# Altium project netv2mvp-testhat-v1.PrjPcb
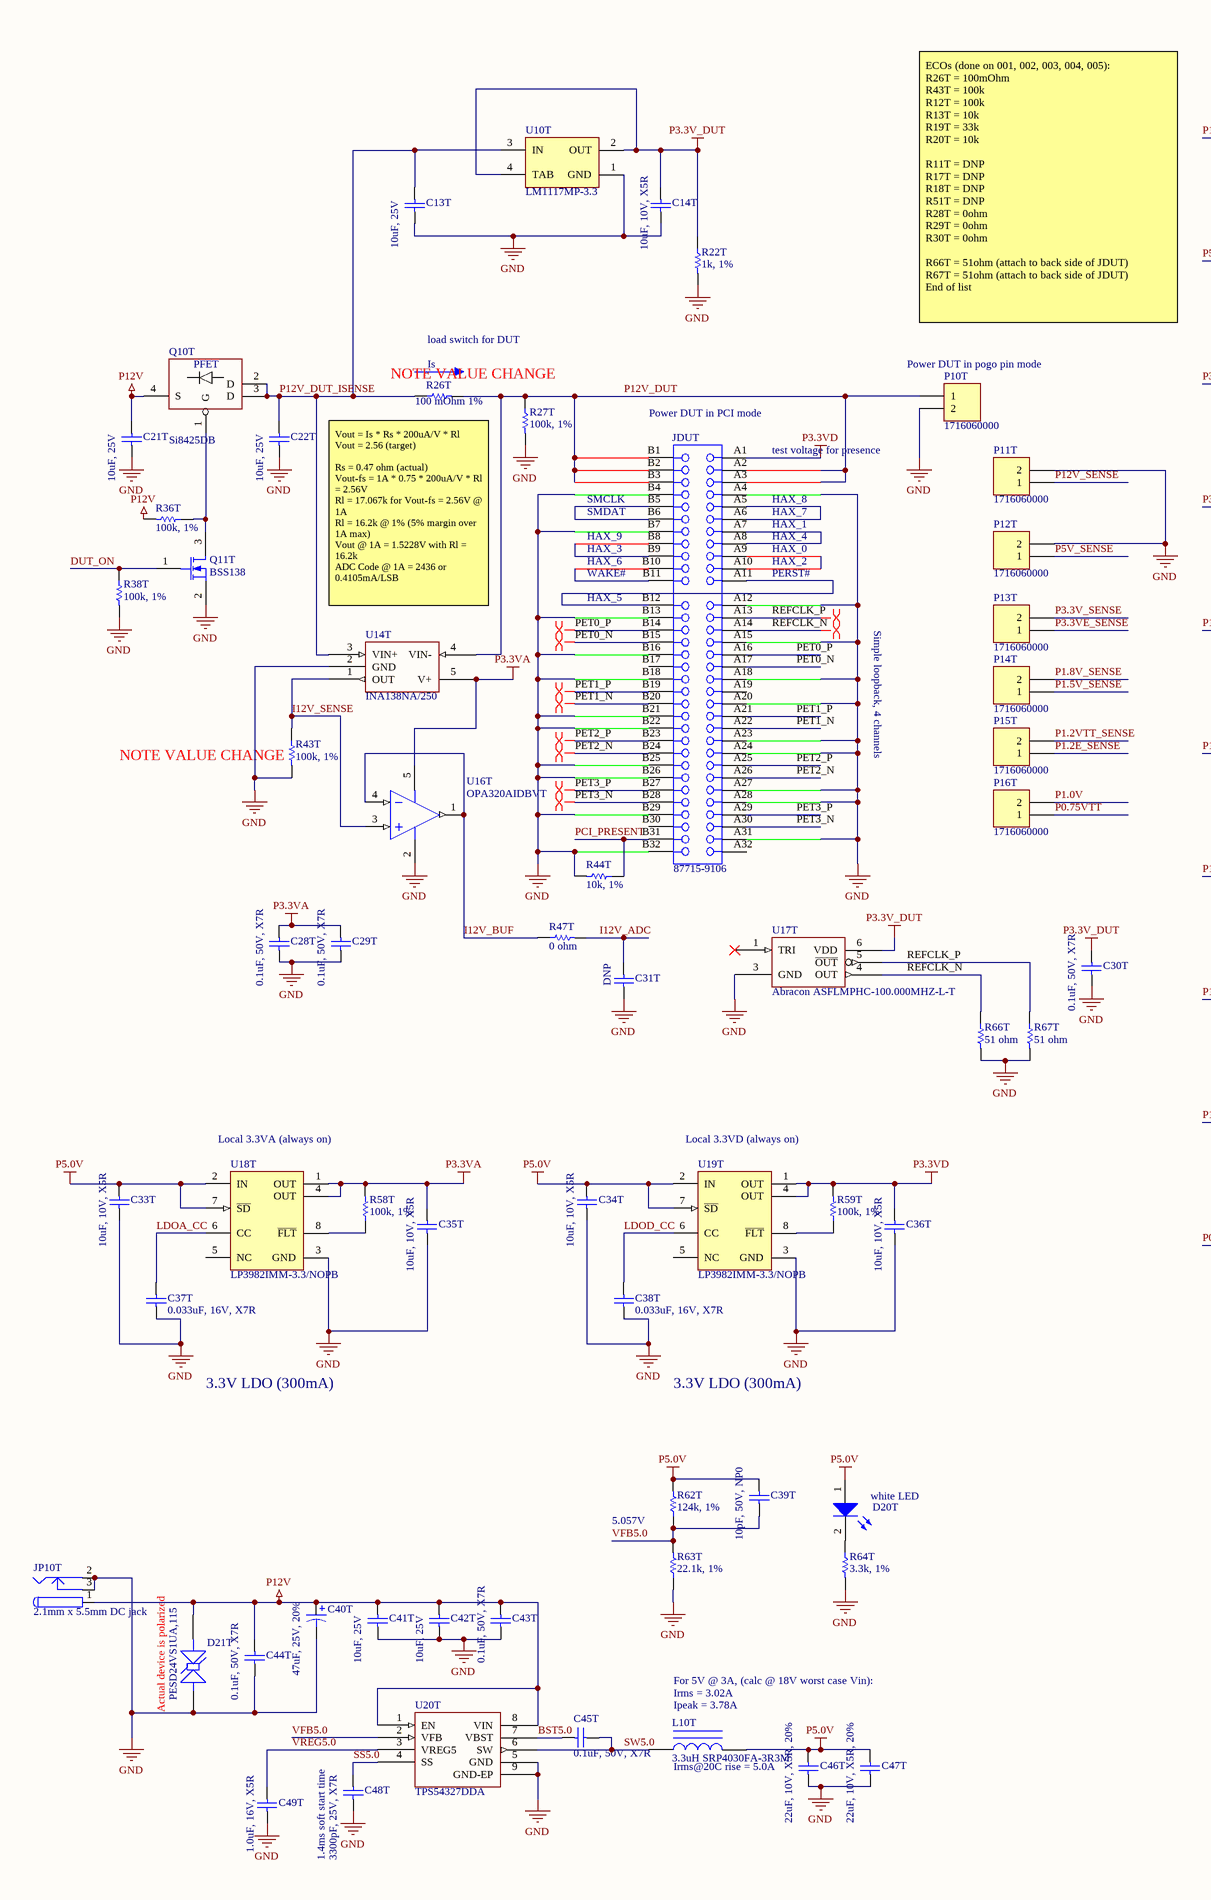
[diagram p0: testhat1.SchDoc, left]
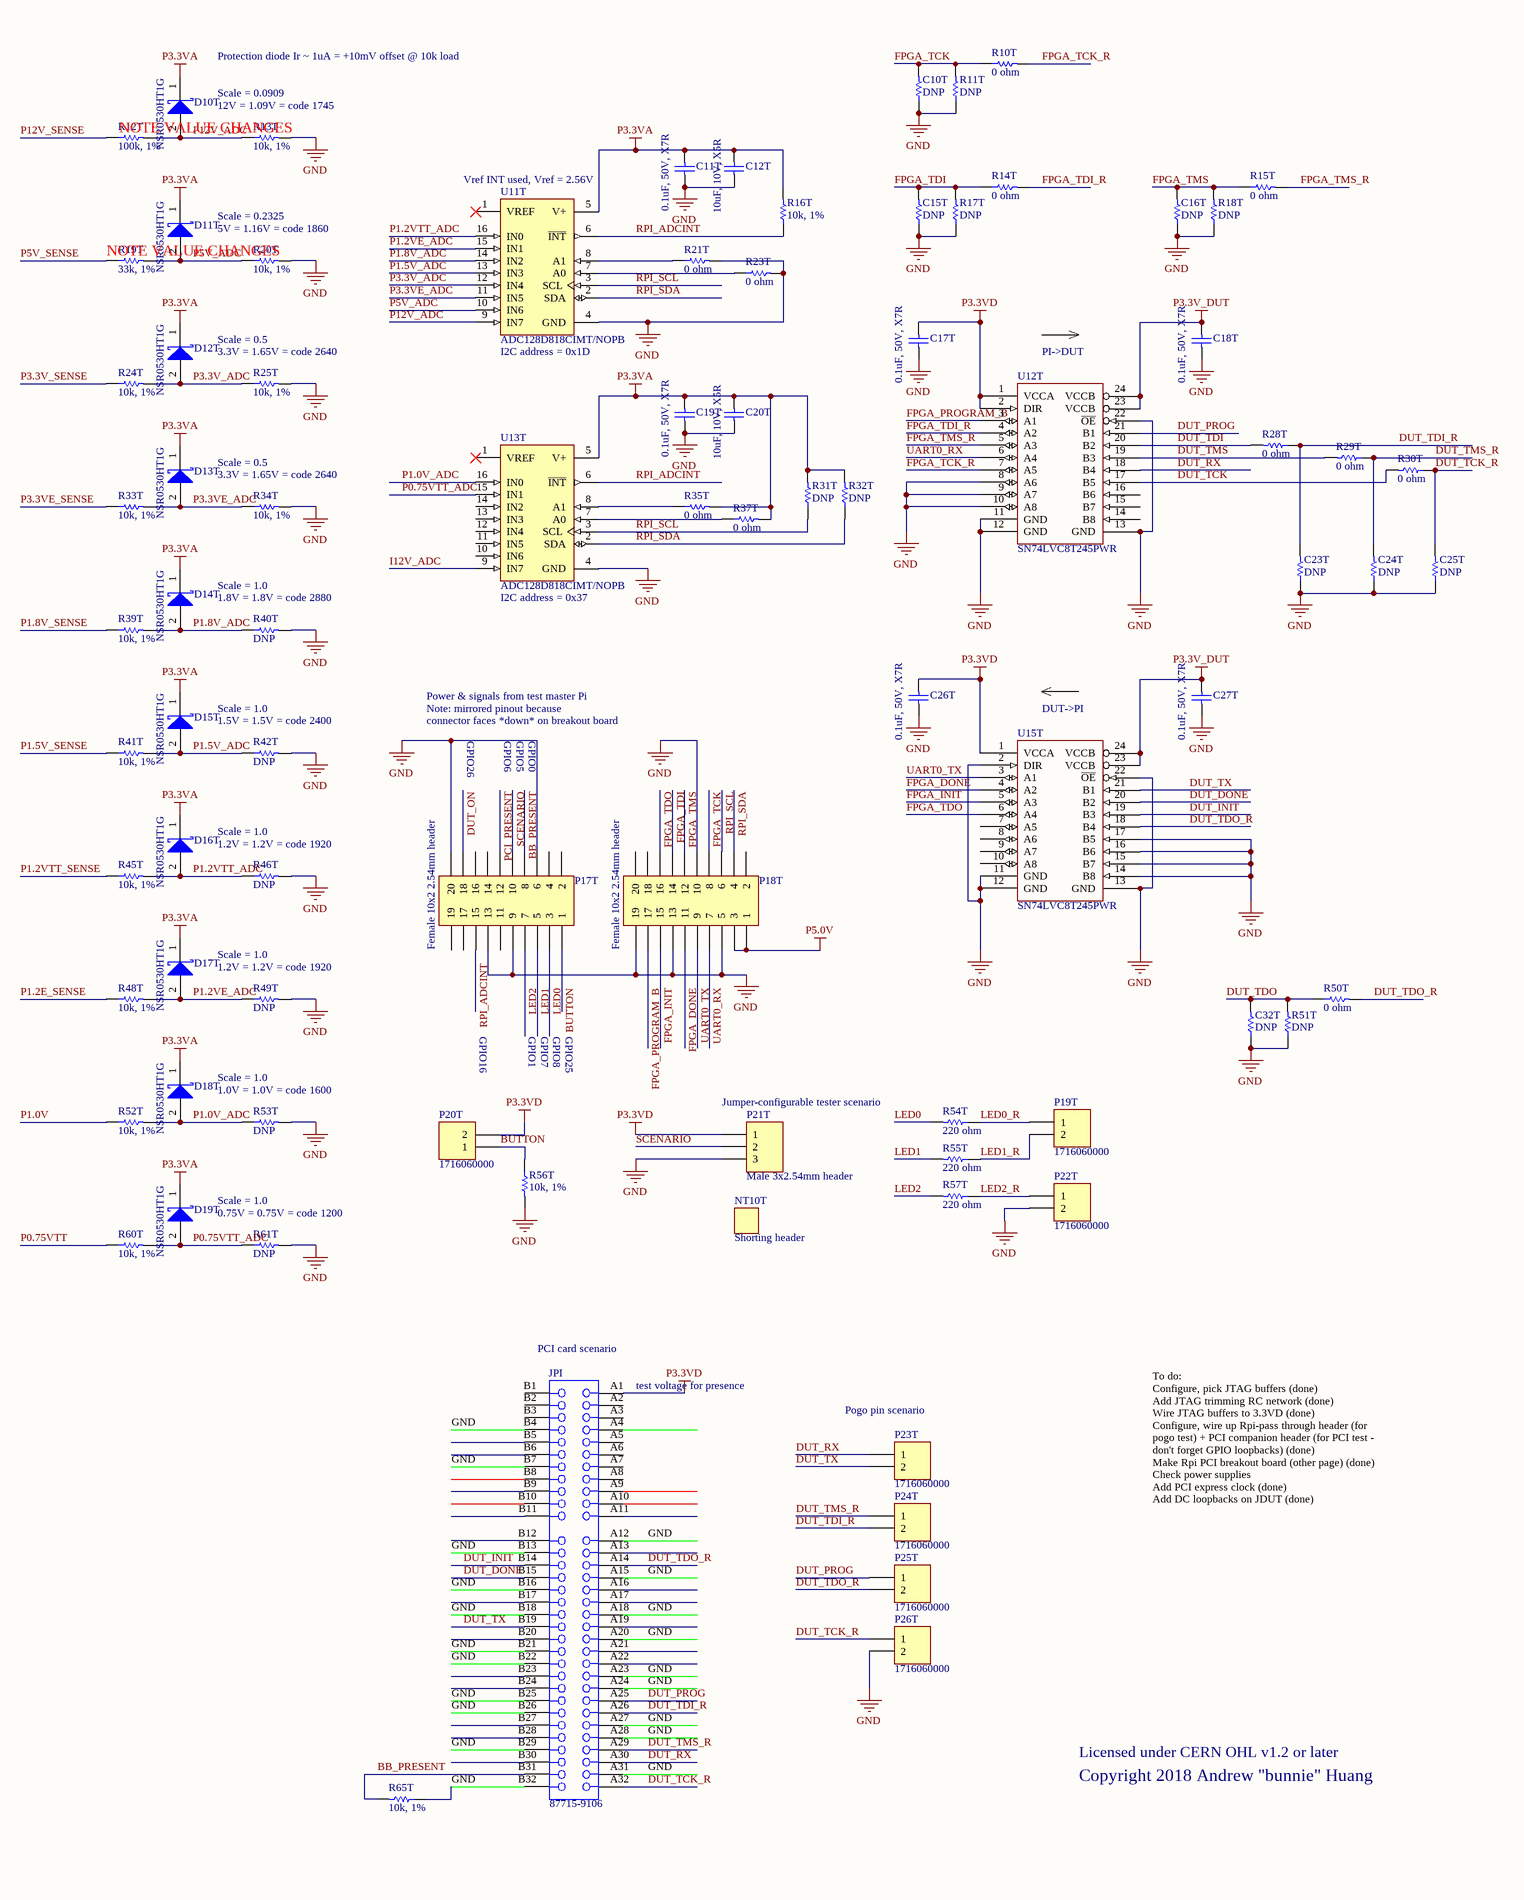
[diagram p1: testhat1.SchDoc, right]
2 sheets, 147 parts. Net scope: global (net labels, ports and power ports of the same name join across sheets).
Board file: netv2mvp-testhat-v1-route.PCBDOC
Sheets:
  testhat1.SchDoc
  pi2pci.SchDoc

## Sheet testhat1.SchDoc
size A2

### Parts
C10T  DNP  [RESC1608N]
C11T  0.1uF, 50V, X7R  [CAPC2012N]
C12T  10uF, 10V, X5R  [CAPC2012N]
C13T  10uF, 25V  [CAPC3216N]
C14T  10uF, 10V, X5R  [CAPC2012N]
C15T  DNP  [RESC1608N]
C16T  DNP  [RESC1608N]
C17T  0.1uF, 50V, X7R  [CAPC2012N]
C18T  0.1uF, 50V, X7R  [CAPC2012N]
C19T  0.1uF, 50V, X7R  [CAPC2012N]
C20T  10uF, 10V, X5R  [CAPC2012N]
C21T  10uF, 25V  [CAPC3216N]
C22T  10uF, 25V  [CAPC3216N]
C23T  DNP  [RESC1608N]
C24T  DNP  [RESC1608N]
C25T  DNP  [RESC1608N]
C26T  0.1uF, 50V, X7R  [CAPC2012N]
C27T  0.1uF, 50V, X7R  [CAPC2012N]
C28T  0.1uF, 50V, X7R  [CAPC2012N]
C29T  0.1uF, 50V, X7R  [CAPC2012N]
C30T  0.1uF, 50V, X7R  [CAPC2012N]
C31T  DNP  [CAPC2012N]
C32T  DNP  [RESC1608N]
C33T  10uF, 10V, X5R  [CAPC2012N]
C34T  10uF, 10V, X5R  [CAPC2012N]
C35T  10uF, 10V, X5R  [CAPC2012N]
C36T  10uF, 10V, X5R  [CAPC2012N]
C37T  0.033uF, 16V, X7R  [CAPC1005N]
C38T  0.033uF, 16V, X7R  [CAPC1005N]
C39T  10pF, 50V, NP0  [CAPC1005N]
C40T  47uF, 25V, 20%  [CAPAE7066X61N]
C41T  10uF, 25V  [CAPC3216N]
C42T  10uF, 25V  [CAPC3216N]
C43T  0.1uF, 50V, X7R  [CAPC2012N]
C44T  0.1uF, 50V, X7R  [CAPC2012N]
C45T  0.1uF, 50V, X7R  [CAPC2012N]
C46T  22uF, 10V, X5R, 20%  [CAPC2012N]
C47T  22uF, 10V, X5R, 20%  [CAPC2012N]
C48T  3300pF, 25V, X7R  [CAPC1005N]
C49T  1.0uF, 16V, X5R  [CAPC1005N]
D10T  NSR0530HT1G  [SOD-323]
D11T  NSR0530HT1G  [SOD-323]
D12T  NSR0530HT1G  [SOD-323]
D13T  NSR0530HT1G  [SOD-323]
D14T  NSR0530HT1G  [SOD-323]
D15T  NSR0530HT1G  [SOD-323]
D16T  NSR0530HT1G  [SOD-323]
D17T  NSR0530HT1G  [SOD-323]
D18T  NSR0530HT1G  [SOD-323]
D19T  NSR0530HT1G  [SOD-323]
D20T  white LED  [CD2012-0805]
D21T  PESD24VS1UA,115  [SOD-323]
JDUT  87715-9106  [BTB1-00-2V64]
JP10T  2.1mm x 5.5mm DC jack  [CUI_PJ_002AH_SMT]
JPI  87715-9106  [BTB1-00-2V64]
L10T  3.3uH SRP4030FA-3R3M  [COILCRAFT_XEL4030]
NT10T  Shorting header
P10T  1716060000  [weidmuller_1716060000]
P11T  1716060000  [weidmuller_1716060000]
P12T  1716060000  [weidmuller_1716060000]
P13T  1716060000  [weidmuller_1716060000]
P14T  1716060000  [weidmuller_1716060000]
P15T  1716060000  [weidmuller_1716060000]
P16T  1716060000  [weidmuller_1716060000]
P17T  Female 10x2 2.54mm header  [HDR2X10]
P18T  Female 10x2 2.54mm header  [HDR2X10]
P19T  1716060000  [weidmuller_1716060000]
P20T  1716060000  [weidmuller_1716060000]
P21T  Male 3x2.54mm header  [HDR1X3]
P22T  1716060000  [weidmuller_1716060000]
P23T  1716060000  [weidmuller_1716060000]
P24T  1716060000  [weidmuller_1716060000]
P25T  1716060000  [weidmuller_1716060000]
P26T  1716060000  [weidmuller_1716060000]
Q10T  Si8425DB  [VISHAY_MICRO_FOOT_4_BUMP]
Q11T  BSS138  [SOT23-3N]
R10T  0 ohm  [RESC1608N]
R11T  DNP  [RESC1608N]
R12T  100k, 1%  [RESC1005N]
R13T  10k, 1%  [RESC1005N]
R14T  0 ohm  [RESC1608N]
R15T  0 ohm  [RESC1608N]
R16T  10k, 1%  [RESC1005N]
R17T  DNP  [RESC1608N]
R18T  DNP  [RESC1608N]
R19T  33k, 1%  [RESC1005N]
R20T  10k, 1%  [RESC1005N]
R21T  0 ohm  [RESC1608N]
R22T  1k, 1%  [RESC1608N]
R23T  0 ohm  [RESC1608N]
R24T  10k, 1%  [RESC1005N]
R25T  10k, 1%  [RESC1005N]
R26T  100 mOhm 1%  [RESC3216N]
R27T  100k, 1%  [RESC1005N]
R28T  0 ohm  [RESC1608N]
R29T  0 ohm  [RESC1608N]
R30T  0 ohm  [RESC1608N]
R31T  DNP  [RESC1005N]
R32T  DNP  [RESC1005N]
R33T  10k, 1%  [RESC1005N]
R34T  10k, 1%  [RESC1005N]
R35T  0 ohm  [RESC1608N]
R36T  100k, 1%  [RESC1005N]
R37T  0 ohm  [RESC1608N]
R38T  100k, 1%  [RESC1005N]
R39T  10k, 1%  [RESC1005N]
R40T  DNP  [RESC1005N]
R41T  10k, 1%  [RESC1005N]
R42T  DNP  [RESC1005N]
R43T  100k, 1%  [RESC1005N]
R44T  10k, 1%  [RESC1005N]
R45T  10k, 1%  [RESC1005N]
R46T  DNP  [RESC1005N]
R47T  0 ohm  [RESC1608N]
R48T  10k, 1%  [RESC1005N]
R49T  DNP  [RESC1005N]
R50T  0 ohm  [RESC1608N]
R51T  DNP  [RESC1608N]
R52T  10k, 1%  [RESC1005N]
R53T  DNP  [RESC1005N]
R54T  220 ohm  [RESC1608N]
R55T  220 ohm  [RESC1608N]
R56T  10k, 1%  [RESC1005N]
R57T  220 ohm  [RESC1608N]
R58T  100k, 1%  [RESC1005N]
R59T  100k, 1%  [RESC1005N]
R60T  10k, 1%  [RESC1005N]
R61T  DNP  [RESC1005N]
R62T  124k, 1%  [RESC1005N]
R63T  22.1k, 1%  [RESC1005N]
R64T  3.3k, 1%  [RESC1005N]
R65T  10k, 1%  [RESC1005N]
R66T  51 ohm  [RESC1608N]
R67T  51 ohm  [RESC1608N]
U10T  LM1117MP-3.3  [MP04A_N]
U11T  ADC128D818CIMT/NOPB  [MTC16_N]
U12T  SN74LVC8T245PWR  [TSOP65P640-24AN]
U13T  ADC128D818CIMT/NOPB  [MTC16_N]
U14T  INA138NA/250  [SOT23-5AN]
U15T  SN74LVC8T245PWR  [TSOP65P640-24AN]
U16T  OPA320AIDBVT  [TI-DBV5_N]
U17T  Abracon ASFLMPHC-100.000MHZ-L-T  [ABRACON_ASFLMP_HC]
U18T  LP3982IMM-3.3/NOPB  [MUA08A_N]
U19T  LP3982IMM-3.3/NOPB  [MUA08A_N]
U20T  TPS54327DDA  [SOIC127P600-8DN]

### Nets
GND: C10T.1 C11T.2 C12T.2 C13T.1 C14T.2 C15T.1 C16T.1 C17T.2 C18T.2 C19T.2 C20T.2 C21T.1 C22T.1 C23T.1 C24T.1 C25T.1 C26T.2 C27T.2 C28T.2 C29T.2 C30T.2 C31T.2 C32T.1 C33T.2 C34T.2 C35T.2 C36T.2 C37T.1 C38T.1 C40T.2 C41T.1 C42T.1 C43T.2 C44T.2 C46T.2 C47T.2 C48T.2 C49T.2 D21T.2(K) JDUT.A4 JDUT.A12 JDUT.A15 JDUT.A18 JDUT.A20 JDUT.A23 JDUT.A24 JDUT.A27 JDUT.A28 JDUT.A31 JDUT.B4 JDUT.B7 JDUT.B13 JDUT.B16 JDUT.B18 JDUT.B21 JDUT.B22 JDUT.B25 JDUT.B26 JDUT.B29 JDUT.B32 JP10T.2 JP10T.3 JPI.A12 JPI.A15 JPI.A18 JPI.A20 JPI.A23 JPI.A24 JPI.A27 JPI.A28 JPI.A31 JPI.B4 JPI.B7 JPI.B13 JPI.B16 JPI.B18 JPI.B21 JPI.B22 JPI.B25 JPI.B26 JPI.B29 JPI.B32 P10T.2 P11T.2 P12T.2 P17T.6 P17T.9 P17T.13 P17T.20 P18T.5 P18T.10 P18T.13 P18T.19 P21T.3 P22T.2 P26T.2 Q11T.2(S) R11T.1 R13T.2 R17T.1 R18T.1 R20T.2 R21T.2 R22T.2 R23T.2 R25T.2 R27T.2 R34T.2 R38T.2 R40T.2 R42T.2 R43T.2 R44T.2 R46T.2 R49T.2 R51T.1 R53T.2 R56T.2 R61T.2 R63T.1 R64T.2 R65T.1 R66T.2 R67T.2 U10T.1(GND) U11T.4(GND) U12T.8(A6) U12T.9(A7) U12T.10(A8) U12T.11(GND) U12T.12(GND) U12T.13(GND) U12T.22(~{OE}) U13T.4(GND) U14T.2(GND) U15T.2(DIR) U15T.11(GND) U15T.12(GND) U15T.13(GND) U15T.14(B8) U15T.15(B7) U15T.16(B6) U15T.17(B5) U15T.22(~{OE}) U16T.2(V-) U17T.3(GND) U18T.3(GND) U19T.3(GND) U20T.5(GND) U20T.9(GND-EP)
P3.3V_DUT: C14T.1 C18T.1 C27T.1 C30T.1 R22T.1 U10T.2(OUT) U10T.4(TAB) U12T.23(VCCB) U12T.24(VCCB) U15T.23(VCCB) U15T.24(VCCB) U17T.6(VDD)
P3.3VA: C11T.1 C12T.1 C19T.1 C20T.1 C28T.1 C29T.1 C35T.1 D10T.1(K) D11T.1(K) D12T.1(K) D13T.1(K) D14T.1(K) D15T.1(K) D16T.1(K) D17T.1(K) D18T.1(K) D19T.1(K) R16T.2 R31T.2 R32T.2 R35T.2 R37T.2 R58T.2 U11T.5(V+) U13T.5(V+) U14T.5(V+) U16T.5(V+) U18T.1(OUT) U18T.4(OUT)
P3.3VD: C17T.1 C26T.1 C36T.1 JDUT.A1 JPI.A1 P20T.2 P21T.1 R59T.2 U12T.1(VCCA) U12T.2(DIR) U15T.1(VCCA) U19T.1(OUT) U19T.4(OUT)
P5.0V: C33T.1 C34T.1 C39T.1 C46T.1 C47T.1 D20T.1(A) L10T.2 P18T.1 P18T.3 R62T.2 U18T.2(IN) U18T.7(~{SD}) U19T.2(IN) U19T.7(~{SD})
P12V: C21T.2 C40T.1 C41T.2 C42T.2 C43T.1 C44T.1 D21T.1(A) JP10T.1 Q10T.4(S) R36T.2 U20T.1(EN) U20T.8(VIN)
BB_PRESENT: JPI.B31 P17T.8 R65T.2
BST5.0: C45T.2 U20T.7(VBST)
BUTTON: P17T.1 P20T.1 R56T.1
DUT_DONE: JPI.B15 U15T.20(B2)
DUT_INIT: JPI.B14 U15T.19(B3)
DUT_ON: P17T.18 Q11T.1(G) R38T.1
DUT_PROG: JPI.A25 P25T.1 U12T.21(B1)
DUT_RX: JPI.A30 P23T.1 U12T.18(B4)
DUT_TCK: R30T.2 U12T.17(B5)
DUT_TCK_R: C25T.2 JPI.A32 P26T.1 R30T.1
DUT_TDI: R28T.2 U12T.20(B2)
DUT_TDI_R: C23T.2 JPI.A26 P24T.2 R28T.1
DUT_TDO: C32T.2 R50T.1 R51T.2
DUT_TDO_R: JPI.A14 P25T.2 R50T.2 U15T.18(B4)
DUT_TMS: R29T.2 U12T.19(B3)
DUT_TMS_R: C24T.2 JPI.A29 P24T.1 R29T.1
DUT_TX: JPI.B19 P23T.2 U15T.21(B1)
FPGA_DONE: P18T.11 U15T.4(A2)
FPGA_INIT: P18T.15 U15T.5(A3)
FPGA_PROGRAM_B: P18T.17 U12T.3(A1)
FPGA_TCK: C10T.2 P18T.8 R10T.1 R11T.2
FPGA_TCK_R: R10T.2 U12T.7(A5)
FPGA_TDI: C15T.2 P18T.14 R14T.1 R17T.2
FPGA_TDI_R: R14T.2 U12T.4(A2)
FPGA_TDO: P18T.16 U15T.6(A4)
FPGA_TMS: C16T.2 P18T.12 R15T.1 R18T.2
FPGA_TMS_R: R15T.2 U12T.5(A3)
I12V_ADC: C31T.1 R47T.2 U13T.9(IN7)
I12V_BUF: R47T.1 U16T.1(OUT) U16T.4(IN-)
I12V_SENSE: R43T.1 U14T.1(OUT) U16T.3(IN+)
LDOA_CC: C37T.2 U18T.6(CC)
LDOD_CC: C38T.2 U19T.6(CC)
LED0: P17T.3 R54T.2
LED0_R: P19T.1 R54T.1
LED1: P17T.5 R55T.2
LED1_R: P19T.2 R55T.1
LED2: P17T.7 R57T.2
LED2_R: P22T.1 R57T.1
P0.75VTT: P16T.1 R60T.1
P0.75VTT_ADC: D19T.2(A) R60T.2 R61T.1 U13T.15(IN1)
P1.0V: P16T.2 R52T.1
P1.0V_ADC: D18T.2(A) R52T.2 R53T.1 U13T.16(IN0)
P1.2E_SENSE: P15T.1 R48T.1
P1.2VE_ADC: D17T.2(A) R48T.2 R49T.1 U11T.15(IN1)
P1.2VTT_ADC: D16T.2(A) R45T.2 R46T.1 U11T.16(IN0)
P1.2VTT_SENSE: P15T.2 R45T.1
P1.5V_ADC: D15T.2(A) R41T.2 R42T.1 U11T.13(IN3)
P1.5V_SENSE: P14T.1 R41T.1
P1.8V_ADC: D14T.2(A) R39T.2 R40T.1 U11T.14(IN2)
P1.8V_SENSE: P14T.2 R39T.1
P3.3V_ADC: D12T.2(A) R24T.2 R25T.1 U11T.12(IN4)
P3.3V_SENSE: P13T.2 R24T.1
P3.3VE_ADC: D13T.2(A) R33T.2 R34T.1 U11T.11(IN5)
P3.3VE_SENSE: P13T.1 R33T.1
P5V_ADC: D11T.2(A) R19T.2 R20T.1 U11T.10(IN6)
P5V_SENSE: P12T.1 R19T.1
P12V_ADC: D10T.2(A) R12T.2 R13T.1 U11T.9(IN7)
P12V_DUT: JDUT.A2 JDUT.A3 JDUT.B1 JDUT.B2 JDUT.B3 P10T.1 R26T.2 R27T.1 U14T.4(VIN-)
P12V_DUT_ISENSE: C13T.2 C22T.2 Q10T.2(D) Q10T.3(D) R26T.1 U10T.3(IN) U14T.3(VIN+)
P12V_SENSE: P11T.1 R12T.1
PCI_PRESENT: JDUT.B31 P17T.12 R44T.1
PET0_N: JDUT.A17 JDUT.B15
PET0_P: JDUT.A16 JDUT.B14
PET1_N: JDUT.A22 JDUT.B20
PET1_P: JDUT.A21 JDUT.B19
PET2_N: JDUT.A26 JDUT.B24
PET2_P: JDUT.A25 JDUT.B23
PET3_N: JDUT.A30 JDUT.B28
PET3_P: JDUT.A29 JDUT.B27
REFCLK_N: JDUT.A14 R66T.1 U17T.4(OUT)
REFCLK_P: JDUT.A13 R67T.1 U17T.5(~{OUT})
RPI_ADCINT: P17T.15 R16T.1 U11T.6(~{INT}) U13T.6(~{INT})
RPI_SCL: P18T.6 R31T.1 U11T.3(SCL) U13T.3(SCL)
RPI_SDA: P18T.4 R32T.1 U11T.2(SDA) U13T.2(SDA)
SCENARIO: P17T.10 P21T.2
SS5.0: C48T.1 U20T.4(SS)
SW5.0: C45T.1 L10T.1 U20T.6(SW)
UART0_RX: P18T.7 U12T.6(A4)
UART0_TX: P18T.9 U15T.3(A1)
VFB5.0: C39T.2 R62T.1 R63T.2 U20T.2(VFB)
VREG5.0: C49T.1 U20T.3(VREG5)
NetD20T_2: D20T.2(K) R64T.1
NetJDUT_A5: JDUT.A5 JDUT.A6
NetJDUT_A7: JDUT.A7 JDUT.A8
NetJDUT_A9: JDUT.A9 JDUT.A10
NetJDUT_A11: JDUT.A11 JDUT.B12
NetJDUT_B5: JDUT.B5 JDUT.B6
NetJDUT_B8: JDUT.B8 JDUT.B9
NetJDUT_B10: JDUT.B10 JDUT.B11
NetQ10T_1: Q10T.1(G) Q11T.3(D) R36T.1
NetR21T_1: R21T.1 U11T.8(A1)
NetR23T_1: R23T.1 U11T.7(A0)
NetR35T_1: R35T.1 U13T.8(A1)
NetR37T_1: R37T.1 U13T.7(A0)
NetR58T_1: R58T.1 U18T.8(~{FLT})
NetR59T_1: R59T.1 U19T.8(~{FLT})

Not connected (* = marked no-connect by the designer): JDUT A19 A32 B17 B30; JPI A2 A3 A4 A5 A6 A7 A8 A9 A10 A11 A13 A16 A17 A19 A21 A22 B1 B2 B3 B5 B6 B8 B9 B10 B11 B12 B17 B20 B23 B24 B27 B28 B30; P17T 2 4 11 14 16 17 19; P18T 2 18 20; U11T 1(VREF)*; U12T 14(B8) 15(B7) 16(B6); U13T 1(VREF)* 10(IN6) 11(IN5) 12(IN4) 13(IN3) 14(IN2); U15T 7(A5) 8(A6) 9(A7) 10(A8); U17T 1(TRI)*; U18T 5(NC); U19T 5(NC)

### Layout directives
differential pair: PET0_N, PET0_P, PET1_N, PET1_P, PET2_N, PET2_P, PET3_N, PET3_P, REFCLK_N, REFCLK_P

### Notes on the sheet
- Scale = 0.0909
- Protection diode Ir ~ 1uA = +10mV offset @ 10k load
- NOTE VALUE CHANGES
- 12V = 1.09V = code 1745
- Scale = 0.2325
- (near U11T) Vref INT used, Vref = 2.56V
- (near R19T) NOTE VALUE CHANGES
- 5V = 1.16V = code 1860
- load switch for DUT
- ECOs (done on 001, 002, 003, 004, 005):
  R26T = 100mOhm
  R43T = 100k
  R12T = 100k
  R13T = 10k
  R19T = 33k
  R20T = 10k
  R11T = DNP
  R17T = DNP
  R18T = DNP
  R51T = DNP
  R28T = 0ohm
  R29T = 0ohm
  R30T = 0ohm
  R66T = 51ohm (attach to back side of JDUT)
  R67T = 51ohm (attach to back side of JDUT)
  End of list
- Scale = 0.5
- (near R26T) NOTE VALUE CHANGE
- (near R26T) Is
- (near P10T) Power DUT in pogo pin mode
- 3.3V = 1.65V = code 2640
- (near U11T) I2C address = 0x1D
- (near U12T) PI->DUT
- (near JDUT) Power DUT in PCI mode
- test voltage for presence
- SMCLK
- SMDAT
- HAX_7
- HAX_8
- HAX_1
- HAX_9
- HAX_3
- HAX_6
- WAKE#
- HAX_4
- HAX_0
- HAX_2
- PERST#
- Scale = 1.0
- Vout = Is * Rs * 200uA/V * Rl
  Vout = 2.56 (target)
  Rs = 0.47 ohm (actual)
  Vout-fs = 1A * 0.75 * 200uA/V * Rl = 2.56V
  Rl = 17.067k for Vout-fs = 2.56V @ 1A
  Rl = 16.2k @ 1% (5% margin over 1A max)
  Vout @ 1A = 1.5228V with Rl = 16.2k
  ADC Code @ 1A = 2436 or 0.4105mA/LSB
- HAX_5
- Simple loopback, 4 channels
- 1.8V = 1.8V = code 2880
- (near U13T) I2C address = 0x37
- Note: mirrored pinout because
- Power & signals from test master Pi
- (near U15T) DUT->PI
- (near R43T) NOTE VALUE CHANGE
- 1.5V = 1.5V = code 2400
- connector faces *down* on breakout board
- GPIO26
- GPIO6
- GPIO5
- GPIO0
- 1.2V = 1.2V = code 1920
- GPIO16
- GPIO1
- GPIO7
- GPIO8
- GPIO25
- Local 3.3VA (always on)
- Local 3.3VD (always on)
- 1.0V = 1.0V = code 1600
- Jumper-configurable tester scenario
- 0.75V = 0.75V = code 1200
- 3.3V LDO (300mA)
- (near JPI) PCI card scenario
- (near JPI) test voltage for presence
- (near P23T) Pogo pin scenario
- To do:
  Configure, pick JTAG buffers (done)
  Add JTAG trimming RC network (done)
  Wire JTAG buffers to 3.3VD (done)
  Configure, wire up Rpi-pass through header (for pogo test) + PCI companion header (for PCI test - don't forget GPIO loopbacks) (done)
  Make Rpi PCI breakout board (other page) (done)
  Check power supplies
  Add PCI express clock (done)
  Add DC loopbacks on JDUT (done)
- 5.057V
- Irms = 3.02A
- For 5V @ 3A, (calc @ 18V worst case Vin):
- (near D21T) Actual device is polarized
- (near L10T) Ipeak = 3.78A
- Licensed under CERN OHL v1.2 or later
- (near L10T) Irms@20C rise = 5.0A
- Copyright 2018 Andrew "bunnie" Huang
- (near C48T) 1.4ms soft start time
- (in symbol Si8425DB) PFET

### Library data of the parts
C10T C15T C16T C23T C24T C25T C32T R11T R17T R18T R31T R32T R40T R42T R46T R49T R51T R53T R61T = Res1: Resistor; VENDOR: ANY; MYPN: DNP; MPN: ANY
C11T C17T C18T C19T C26T C27T C28T C29T C30T C43T C44T C45T = Cap Semi: Capacitor (Semiconductor SIM Model); MPN: CL21B104KBCNNWC; VENDOR: Samsung; MYPN: C-104-50-X7R-0805
C12T C14T C20T C33T C34T C35T C36T = Cap Semi: Capacitor (Semiconductor SIM Model); MPN: CL21A106KPCLQNC; VENDOR: Samsung; MYPN: C-106-10-X5R-0805
C13T C21T C22T C41T C42T = Cap Semi: Capacitor (Semiconductor SIM Model); MPN: CL31A106KBHNNNE; VENDOR: Samsung; MYPN: C-106-50-X5R-1206
C31T = Cap Semi: Capacitor (Semiconductor SIM Model); VENDOR: None; MPN: DNP; MYPN: DNP
C37T C38T = Cap Semi: Capacitor (Semiconductor SIM Model); MPN: CL05B333KO5NNNC; VENDOR: Samsung; MYPN: C-333-16-X7R-0402
C39T = Cap Semi: Capacitor (Semiconductor SIM Model); MPN: GCM1555C1H100JA16D; VENDOR: Murata; MYPN: C-100-50-NP0-0402
C40T = Cap Pol1: Polarized Capacitor (Radial); MPN: UCL1E470MCL1GS; VENDOR: Nichicon; MYPN: C-476-25-UCL-6.3x5.8
C46T C47T = Cap Semi: Capacitor (Semiconductor SIM Model); MPN: GRM21BR61A226ME51L; MFG: Murata; MYPN: C-226-10-X5R-0805; Published: 8-Jun-2000; LatestRevisionDate: 17-Jul-2002; LatestRevisionNote: Re-released for DXP Platform.; PackageReference: C1206; Publisher: Altium Limited
C48T = Cap Semi: Capacitor (Semiconductor SIM Model); MPN: CL05B332KA5NNNC; VENDOR: Samsung; MYPN: C-332-25-X7R-0402
C49T = Cap Semi: Capacitor (Semiconductor SIM Model); MPN: ANY; MYPN: C-105-6p3-X5R-0402; VENDOR: ANY
D10T D11T D12T D13T D14T D15T D16T D17T D18T D19T = D Schottky: Schottky Diode; MPN: NSR0530H-D; VENDOR: Semtech HK LTD; MYPN: D-S-0p5-30-0p37-SOD323; Revision: July-2002: Re-released for DXP Platform.
D20T = LED2: Typical RED, GREEN, YELLOW, AMBER GaAs LED; MPN: CB-2012QWC-P8; VENDOR: CITYBRIGHT; MYPN: D-LED-WHITE1-0805
D21T = BIDIR_ESD: Bidirectional zener diode, Vz 17.1V nom; MYPN: U-PESD24VL1BA,115; VENDOR: NXP; MPN: PESD24VS1UA,115
JDUT = CMP-0001-00127-1: Board-to-Board Connector, PTH, Vertical, Pitch 1.00mm, 64-Position; MPN: 0877159106; Mating Connector: PCIeX4-GF-2D-1000-1K-O64; VENDOR: Molex; MYPN: J-PCIEx4-F; Datasheet Version: Jul-2007; Publisher: Altium; ClassName: Board Template Connector; Package Reference: BTB1-00-2V64; Component Kind: Standard
JP10T = PWR2.5: Low Voltage Power Supply Connector; MPN: DC-480-2.0A-SMT; MYPN: J-PJ-002AH-SMT-TR; VENDOR: KAWEEI; Published: 17-Dec-2003; Datasheet: Latest Revision: 09-May-2002; Publisher: Altium Limited
JPI = CMP-0001-00127-1: Board-to-Board Connector, PTH, Vertical, Pitch 1.00mm, 64-Position; MPN: 0877159106; Mating Connector: PCIeX4-GF-2D-1000-1K-O64; VENDOR: MOLEX; MYPN: J-PCIEx4-F; Datasheet Version: Jul-2007; Publisher: Altium; ClassName: Board Template Connector; Package Reference: BTB1-00-2V64; Component Kind: Standard
L10T = Inductor Iron: Magnetic-Core Inductor; MPN: XEL4030-332ME_; VENDOR: COILCRAFT; MYPN: L-XEL4030-332ME_
NT10T = NOTE: Placeholder for non-board BOM items; MPN: NPB02SVAN-RC; MYPN: NT-JP-2.54MM-SHORT; VENDOR: Sullivans
P10T P11T P12T P13T P14T P15T P16T P19T P20T P22T P23T P24T P25T P26T = Header 2: Header, 2-Pin; VENDOR: Weidmuller; MYPN: J-TB-2P-5.08; LatestRevisionDate: 17-Jul-2002; LatestRevisionNote: Re-released for DXP Platform.; Publisher: Altium Limited; MPN: 1716060000
P17T P18T = Header 10X2: Header, 10-Pin, Dual row; MPN: F201-SGP-D048-20-P4; VENDOR: KAWAEEI; MYPN: ESW-110-44-L-D; LatestRevisionDate: 17-Jul-2002; LatestRevisionNote: Re-released for DXP Platform.; Publisher: Altium Limited
P21T = Header 3: Header, 3-Pin; MPN: CP25411-03G-S116-X; VENDOR: KAWEEI; MYPN: H-M3P-2.54-1R-6MM; LatestRevisionDate: 17-Jul-2002; LatestRevisionNote: Re-released for DXP Platform.; Publisher: Altium Limited
Q10T = Si8425DB: P-channel 20V 6.2A 27mOhm @ -2.5V; MPN: Si8425DB-T1-E1; VENDOR: Vishay Siliconix; MYPN: QSi8525
Q11T = MOSFET-N: N-Channel MOSFET; MPN: BSS138LT1G; VENDOR: ON Semiconductor; MYPN: Q-BSS138LT1G; Published: 8-Jun-2000; LatestRevisionDate: 17-Jul-2002; LatestRevisionNote: Re-released for DXP Platform.; PackageVersion: 1995/1996; PackageReference: E3; Publisher: Altium Limited
R10T R14T R15T R21T R23T R28T R29T R30T R35T R37T R47T R50T = Res1: Resistor; VENDOR: ANY; MYPN: R-0R0-1P-1_16W-0603; MPN: ANY
R12T R27T R36T R38T R43T R58T R59T = Res1: Resistor; VENDOR: ANY; MYPN: R-104-1P-1_16W-0402; MPN: ANY
R13T R20T R24T R25T R33T R34T R39T R41T R44T R45T R48T R52T R56T R60T R65T = Res1: Resistor; VENDOR: ANY; MYPN: R-103-1P-1_16W-0402; MPN: ANY
R16T R19T = Res1: Resistor; VENDOR: ANY; MYPN: R-333-1P-1_16W-0402; MPN: ANY
R22T = Res1: Resistor; Value: 100k; VENDOR: ANY; MYPN: R-102-1P-1_16W-0402; Published: 8-Jun-2000; LatestRevisionDate: 17-Jul-2002; LatestRevisionNote: Re-released for DXP Platform.; PackageReference: AXIAL-0.3; Publisher: Altium Limited; MPN: ANY
R26T = Res1: Resistor; MPN: ECO; VENDOR: Yageo; MYPN: R-0R100-1P-1_4W-1206
R54T R55T R57T = Res1: Resistor; VENDOR: ANY; MYPN: R-221-1P-1_16W-0603; MPN: ANY
R62T = Res1: Resistor; VENDOR: ANY; MYPN: R-1243-1P-1_16W-0402; MPN: ANY
R63T = Res1: Resistor; VENDOR: ANY; MYPN: R-2212-1P-1_16W-0402; MPN: ANY
R64T = Res1: Resistor; MPN: RS02U332FT; Value: 100k; VENDOR: Fenghua; MYPN: R-332-1P-1_16W-0402; Published: 8-Jun-2000; LatestRevisionDate: 17-Jul-2002; LatestRevisionNote: Re-released for DXP Platform.; PackageReference: AXIAL-0.3; Publisher: Altium Limited
R66T R67T = Res1: Resistor; VENDOR: ANY; MYPN: R-510-1P-1_16W-0603; MPN: ANY
U10T = LM1117MP-3.3: 800mA Low-Dropout Linear Regulator, 4-pin SOT-223; Manufacturer: National Semiconductor; PackageTopMarking: XYTT*N05A; PowerWise: N; CompType: LDO IC; High-Reliability: Y; VENDOR: TI; MYPN: U-LM1117MP-3.3; DatasheetVersion: Apr-2006; PackageVersion: revB, Apr-2003; PackageReference: MP04A; PackageDescription: Molded SOT-223, 6.50 x 3.56 x 1.6mm Body, 4 Lead, 2.3mm Pitch; PartNumber: LM1117MP-3.3; RoHS: N; PinCount: 4; Code_JEDEC: TO-261-AA; Code_IPC: SOT223-4; ComponentLink1Description: Manufacturer URL; ComponentLink1URL: http://www.national.com/; ComponentLink2Description: LM1117 Datasheet; ComponentLink2URL: http://www.national.com/ds/LM/LM1117.pdf; ComponentLink3Description: LM1117 Web Page; ComponentLink3URL: http://www.national.com/pf/LM/LM1117.html; ComponentLink4Description: MP04A Package Page; ComponentLink4URL: http://www.national.com/packaging/folders/mp04a.html; MPN: LM1117MP-3.3
U11T U13T = ADC128D818CIMT/NOPB: 12-Bit, 8-Channel, ADC System Monitor with Temperature Sensor, Internal/External Reference, and I2C Interface, 16 pin TSSOP, Pb-Free; Manufacturer: National Semiconductor; PackageTopMarking: NSUZXYTT*128D818*CIMT; PowerWise: N; CompType: ADC IC; High-Reliability: Y; VENDOR: TI; MYPN: U-ADC128D818CIMT/NOPB; DatasheetVersion: Feb-2010; PackageVersion: revD, Jun-2003; PackageReference: MTC16; PackageDescription: Molded TSSOP, Jedec, 5 x 4.4 x 0.9mm Body, 16 Lead, 0.65mm Pitch; PartNumber: ADC128D818CIMT/NOPB; RoHS: Y; PinCount: 16; Code_JEDEC: MO-153-AB; ComponentLink1Description: ADC128D818 Datasheet; ComponentLink1URL: http://www.national.com/ds/AD/ADC128D818.pdf; ComponentLink2Description: ADC128D818 Web Page; ComponentLink2URL: http://www.national.com/pf/AD/ADC128D818.html; ComponentLink3Description: MTC16 Package Page; ComponentLink3URL: http://www.national.com/packaging/folders/mtc16.html; MPN: ADC128D818CIMT/NOPB
U12T = SN74LVC8T245PWR: 8-bit dual-supply transceiver; VENDOR: TI; MYPN: U-SN74LVC8T245; MPN: SN74LVC8T245PW
U14T = INA138NA/250: High-side measurement current shunt monitor; VENDOR: TI; MYPN: U-INA138NA/250; MPN: INA138NA/250
U15T = SN74LVC8T245PWR: 8-bit dual-supply transceiver
U16T = OPA320AIDBVT: Precision, 20 MHz, 0.9 pA Ib, RRIO, CMOS Operational Amplifier, 1.8 to 5.5 V, -40 to 125 degC, 5-pin SOT23 (DBV5), Green (RoHS & no Sb/Br); Manufacturer: Texas Instruments; CMRR(Min)(dB): 100; IIB(Max)(pA): 0.9; Iq per channel(Max)(mA): 1.75; Number of Channels: 2; Offset Drift(Typ)(uV/C): 1.5; Slew Rate(Typ)(V/us): 10; Sub Family: High Output Current Amplifier (>=50mA), Low Input Bias Current Amp (<=10pA), Low Noise Amp (<=10nV/rtHz), Low Offset Voltage Amplifier (<=500uV), Low Supply Voltage Amplifier (<=2.7V), Precision Amplifier; Total Supply Voltage(Max)(+5V is 5, +/-5V is 10): 5.5; Total Supply Voltage(Min)(+5V is 5, +/-5V is 10): 1.8; Vio (25C)(Max)(mV): 0.15; Vn at 1kHz(Typ)(nV/rtHz): 8.5; MYPN: U-OPA320AIDBVT; VENDOR: TI; DatasheetVersion: SBOS513D; PackageVersion: 4073253-4/K, 03/2006; PackageReference: DBV5; PackageDescription: 5-Pin Plastic Small Outline, Body 1.6 x 2.9 mm, Pitch 0.95 mm; Supplier 1: Digi-Key; Supplier Part Number 1: 296-29510-2-ND; Supplier 2: Digi-Key; Supplier Part Number 2: 296-29510-1-ND; Supplier 3: Digi-Key; Supplier Part Number 3: 296-29510-6-ND; Supplier 4: Farnell; Supplier Part Number 4: 2057093; Supplier 5: Newark; Supplier Part Number 5: 64T3763; Supplier 6: Newark; Supplier Part Number 6: 64T3764; Supplier 7: Mouser; Supplier Part Number 7: 595-OPA320AIDBVT; Eco-Plan: Green (RoHS & no Sb/Br); Mounting Technology: Surface Mount; Code_JEDEC: MO-178; PartNumber: OPA320AIDBVT; ComponentLink1Description: Manufacturer URL; ComponentLink1URL: http://www.ti.com/; ComponentLink2Description: Datasheet; ComponentLink2URL: http://www.ti.com/general/docs/lit/getliterature.tsp?genericPartNumber=OPA320&fileType=pdf; ComponentLink3Description: Package Specification; ComponentLink3URL: http://www.ti.com/litv/pdf/mpds018i; MPN: OPA320AIDBVT
U17T = HCSL-OSC: Abracon Plastic Package Ultra Miniature Pure Silicon Clock Oscillator; MYPN: X-ASFLMPHC-100MHz; MPN: ASFLMPHC-100.000MHZ-L-T; VENDOR: Abracon
U18T U19T = LP3982IMM-3.3/NOPB: Micropower, Ultra Low-Dropout, Low-Noise, 300mA CMOS Regulator, 8-pin Mini SOIC, Pb-Free; Manufacturer: National Semiconductor; PackageTopMarking: ZXTT*LEUB; PowerWise: N; CompType: LDO IC; High-Reliability: Y; MYPN: ULP3982IMM-3.3/NOPB; VENDOR: TI; DatasheetVersion: Mar-2006; PackageVersion: revF, Apr-2008; PackageReference: MUA08A; PackageDescription: MINI SOIC, .118 x .118 x .034in, 8 Lead, .0256in Pitch; PartNumber: LP3982IMM-3.3/NOPB; RoHS: Y; PinCount: 8; Code_JEDEC: MO-187-AA; ComponentLink1Description: Manufacturer URL; ComponentLink1URL: http://www.national.com/; ComponentLink2Description: LP3982 Datasheet; ComponentLink2URL: http://www.national.com/ds/LP/LP3982.pdf; ComponentLink3Description: LP3982 Web Page; ComponentLink3URL: http://www.national.com/pf/LP/LP3982.html; ComponentLink4Description: MUA08A Package Page; ComponentLink4URL: http://www.national.com/packaging/folders/mua08a.html; MPN: LP3982IMM-3.3/NOPB
U20T = TPS54327DDA: 3-A Output Single Synchronous Step-Down Buck with Integrated FET; MPN: TPS54327DDA(R); MYPN: U-TPS54327DDA; VENDOR: TI

## Sheet pi2pci.SchDoc
size A
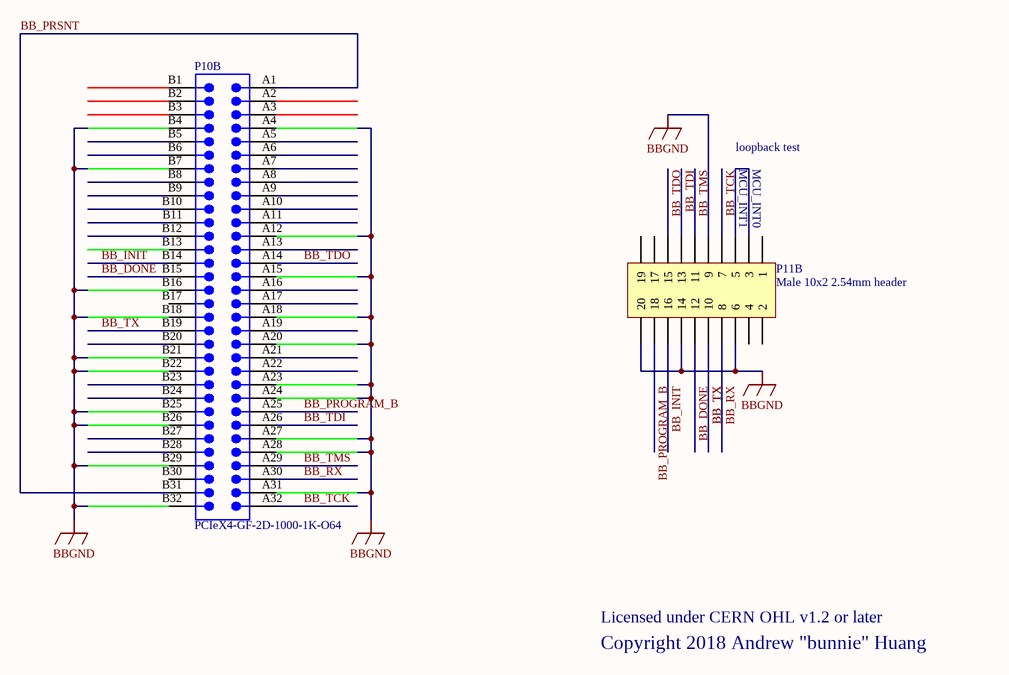
[diagram p2: pi2pci.SchDoc]

### Parts
P10B  PCIeX4-GF-2D-1000-1K-O64  [PCIeX4-GF-2D-1000-1K-O64]  (no BOM)
P11B  Male 10x2 2.54mm header  [HDR2X10]

### Nets
BBGND: P10B.A4 P10B.A12 P10B.A15 P10B.A18 P10B.A20 P10B.A23 P10B.A24 P10B.A27 P10B.A28 P10B.A31 P10B.B4 P10B.B7 P10B.B16 P10B.B18 P10B.B21 P10B.B22 P10B.B25 P10B.B26 P10B.B29 P10B.B32 P11B.6 P11B.9 P11B.14 P11B.20
BB_DONE: P10B.B15 P11B.12
BB_INIT: P10B.B14 P11B.16
BB_PROGRAM_B: P10B.A25 P11B.18
BB_PRSNT: P10B.A1 P10B.B31
BB_RX: P10B.A30 P11B.8
BB_TCK: P10B.A32 P11B.7
BB_TDI: P10B.A26 P11B.13
BB_TDO: P10B.A14 P11B.15
BB_TMS: P10B.A29 P11B.11
BB_TX: P10B.B19 P11B.10
NetP11B_3: P11B.3 P11B.5

Not connected (* = marked no-connect by the designer): P10B A2 A3 A5 A6 A7 A8 A9 A10 A11 A13 A16 A17 A19 A21 A22 B1 B2 B3 B5 B6 B8 B9 B10 B11 B12 B13 B17 B20 B23 B24 B27 B28 B30; P11B 1 2 4 17 19

### Notes on the sheet
- loopback test
- (near P11B) MCU_INT1
- (near P11B) MCU_INT0
- Licensed under CERN OHL v1.2 or later
- Copyright 2018 Andrew "bunnie" Huang

### Library data of the parts
P10B = CMP-0001-00031-1: Golden finger, PCIeX4, Dual, Opposite, Pitch 1mm, 64-Position; Mating Connector: Molex-87715-9106; Datasheet Version: rev2.0, Apr-2007; Package Reference: PCIeX4-GF-2D-1000-1K-O64; ClassName: Edge Connector; Publisher: Altium
P11B = Header 10X2: Header, 10-Pin, Dual row; MPN: CP25412-020-G116-A; VENDOR: KAWAEEI; MYPN: J-2x20-2.54-MALE; LatestRevisionDate: 17-Jul-2002; LatestRevisionNote: Re-released for DXP Platform.; Publisher: Altium Limited